# EasyEDA schematic SCH_GP40_keyboard.json
TITLE: GALAKSIJA Cherry MX Keyboard; REV: 1.0; Date: 2024-01-01; Sheet: 1/1; Drawn By: mikica; Company: Umuntu ngumuntu ngabuntu
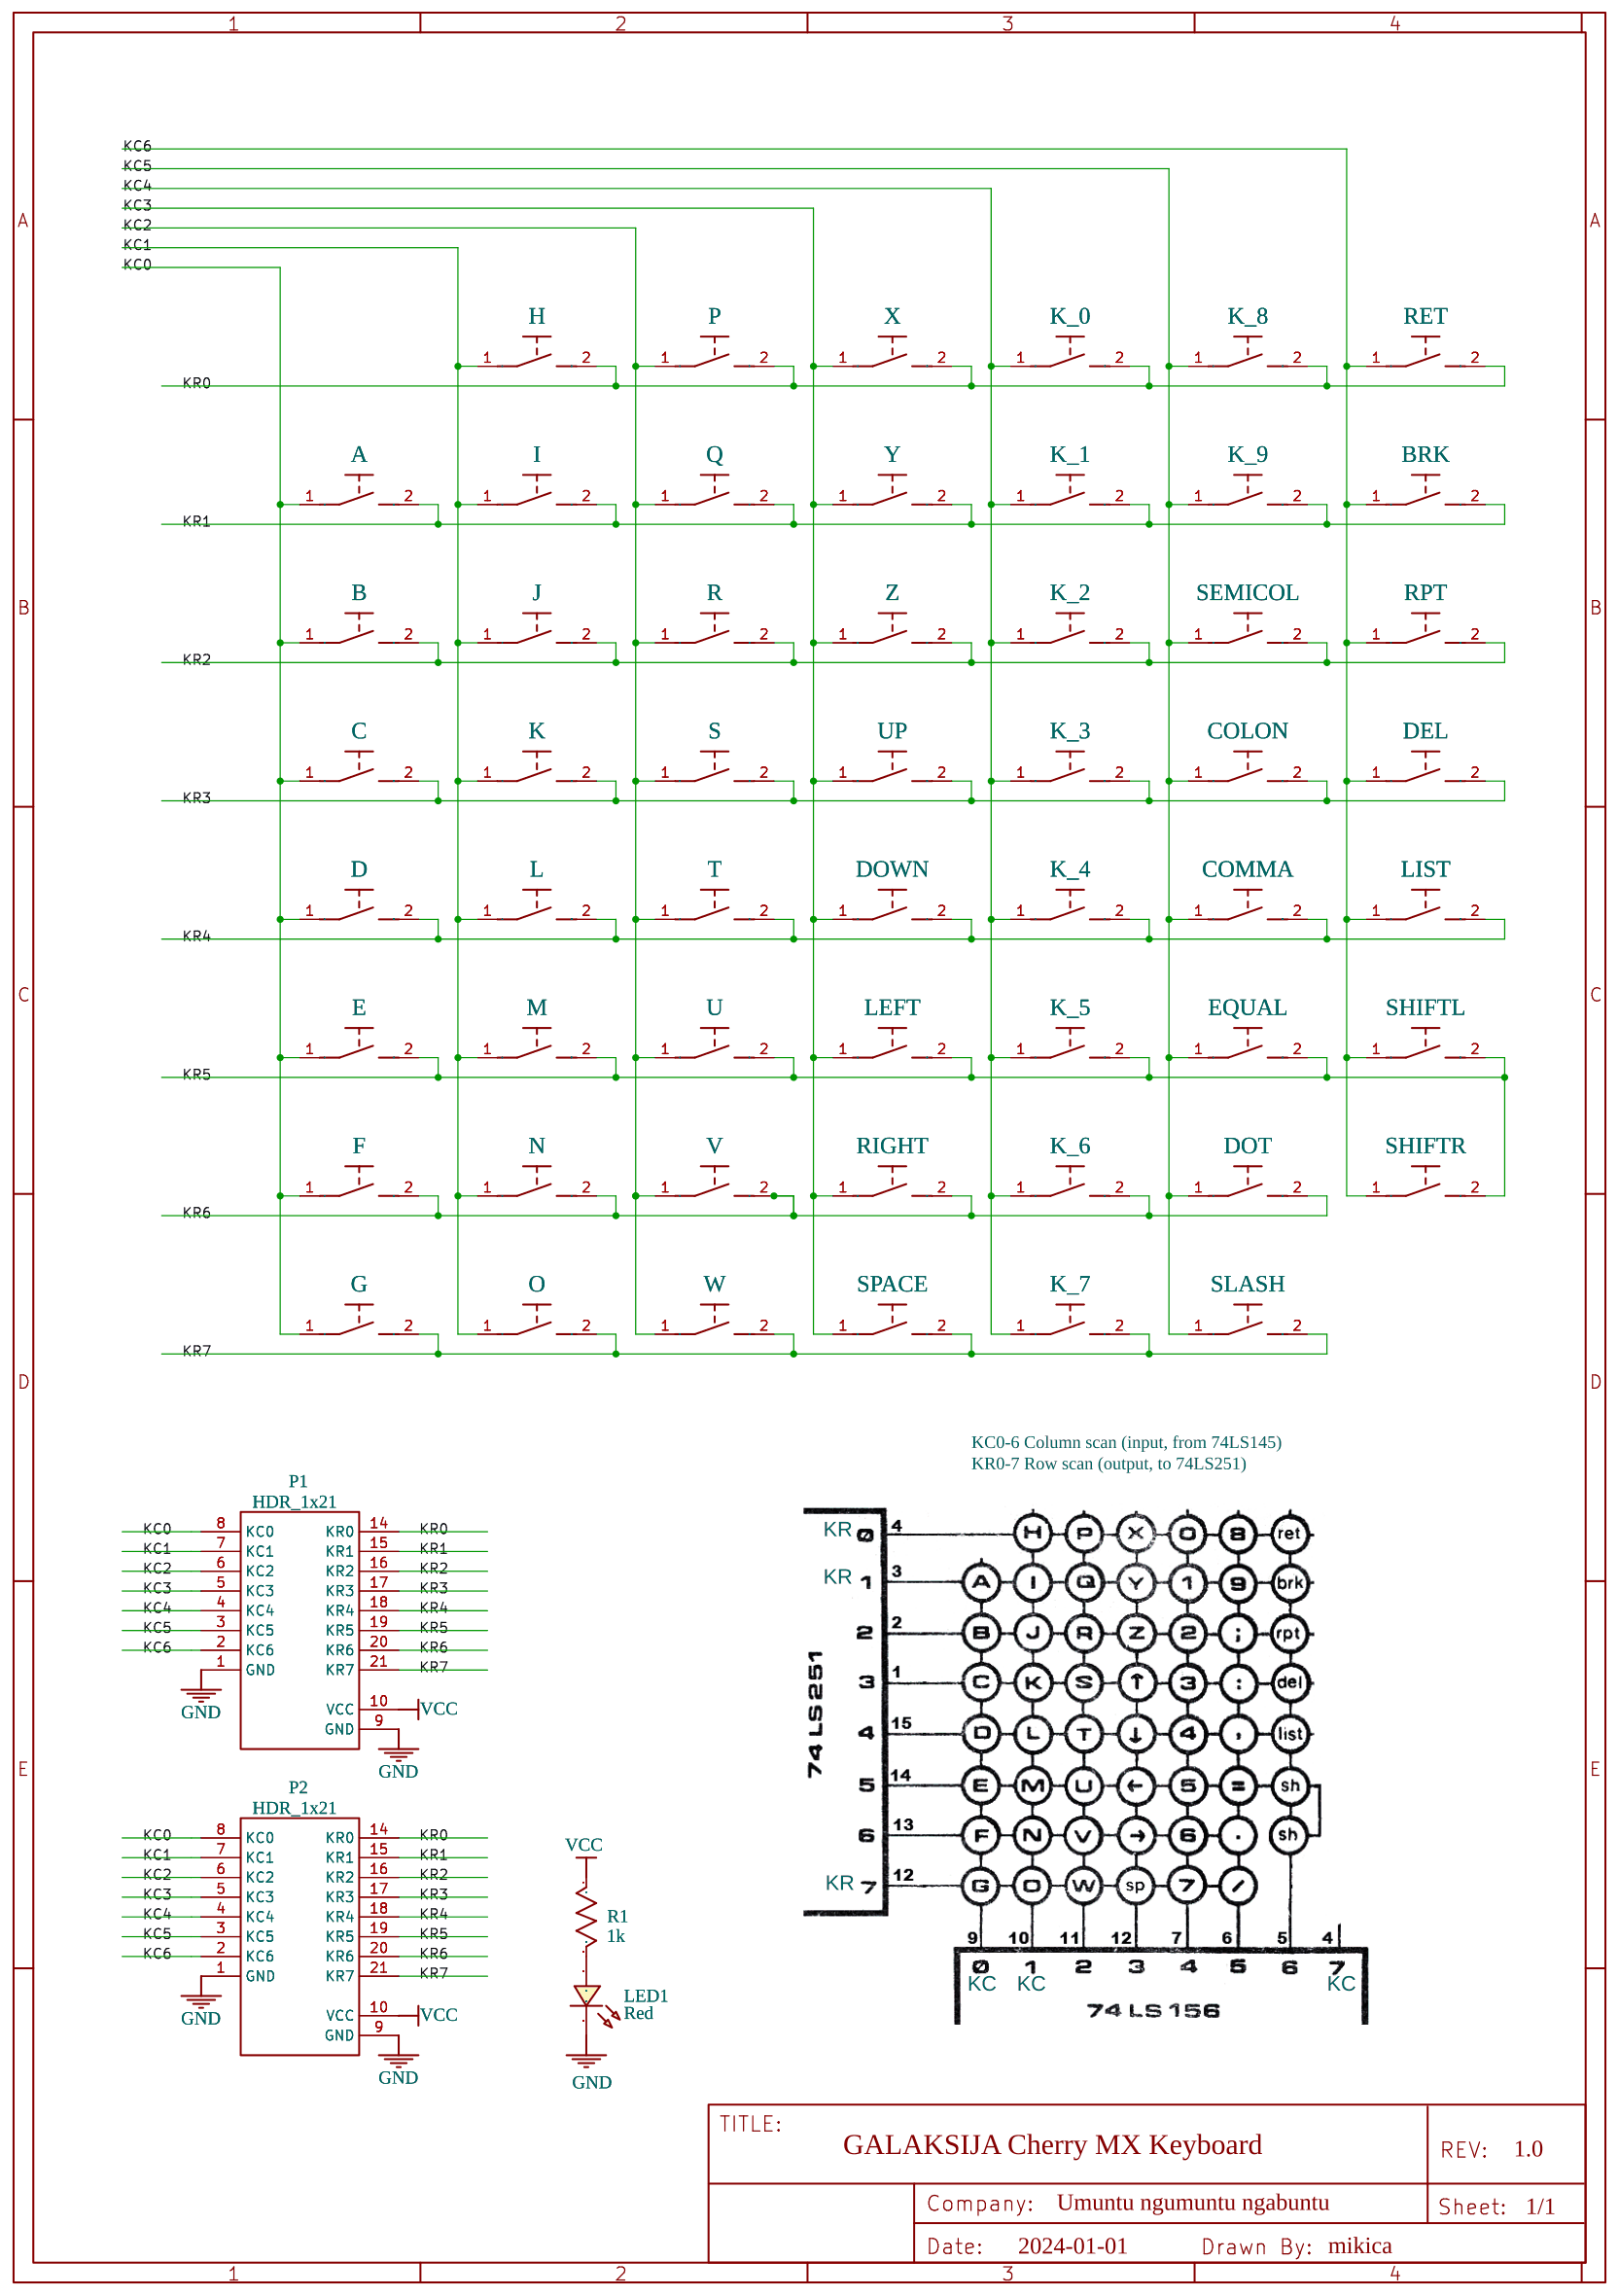
[diagram p0: schematic sheet]

## Parts
A  CPG151101S21  [KEY-TH_CPG1511F01S0X_MK]
B  CPG151101S21  [KEY-TH_CPG1511F01S0X_MK]
BRK  CPG151101S21  [KEY-TH_CPG1511F01S0X_MK]
C  CPG151101S21  [KEY-TH_CPG1511F01S0X_MK]
COLON  CPG151101S21  [KEY-TH_CPG1511F01S0X_MK]
COMMA  CPG151101S21  [KEY-TH_CPG1511F01S0X_MK]
D  CPG151101S21  [KEY-TH_CPG1511F01S0X_MK]
DEL  CPG151101S21  [KEY-TH_CPG1511F01S0X_MK]
DOT  CPG151101S21  [KEY-TH_CPG1511F01S0X_MK]
DOWN  CPG151101S21  [KEY-TH_CPG1511F01S0X_MK]
E  CPG151101S21  [KEY-TH_CPG1511F01S0X_MK]
EQUAL  CPG151101S21  [KEY-TH_CPG1511F01S0X_MK]
F  CPG151101S21  [KEY-TH_CPG1511F01S0X_MK]
G  CPG151101S21  [KEY-TH_CPG1511F01S0X_MK]
H  CPG151101S21  [KEY-TH_CPG1511F01S0X_MK]
I  CPG151101S21  [KEY-TH_CPG1511F01S0X_MK]
J  CPG151101S21  [KEY-TH_CPG1511F01S0X_MK]
K  CPG151101S21  [KEY-TH_CPG1511F01S0X_MK]
K_0  CPG151101S21  [KEY-TH_CPG1511F01S0X_MK]
K_1  CPG151101S21  [KEY-TH_CPG1511F01S0X_MK]
K_2  CPG151101S21  [KEY-TH_CPG1511F01S0X_MK]
K_3  CPG151101S21  [KEY-TH_CPG1511F01S0X_MK]
K_4  CPG151101S21  [KEY-TH_CPG1511F01S0X_MK]
K_5  CPG151101S21  [KEY-TH_CPG1511F01S0X_MK]
K_6  CPG151101S21  [KEY-TH_CPG1511F01S0X_MK]
K_7  CPG151101S21  [KEY-TH_CPG1511F01S0X_MK]
K_8  CPG151101S21  [KEY-TH_CPG1511F01S0X_MK]
K_9  CPG151101S21  [KEY-TH_CPG1511F01S0X_MK]
L  CPG151101S21  [KEY-TH_CPG1511F01S0X_MK]
LED1  Red  [LED-TH_BD3.0_RED]
LEFT  CPG151101S21  [KEY-TH_CPG1511F01S0X_MK]
LIST  CPG151101S21  [KEY-TH_CPG1511F01S0X_MK]
M  CPG151101S21  [KEY-TH_CPG1511F01S0X_MK]
N  CPG151101S21  [KEY-TH_CPG1511F01S0X_MK]
O  CPG151101S21  [KEY-TH_CPG1511F01S0X_MK]
P  CPG151101S21  [KEY-TH_CPG1511F01S0X_MK]
P1  HDR_1x21  [GP40_KBD]
P2  HDR_1x21  [GP40_KBD]
Q  CPG151101S21  [KEY-TH_CPG1511F01S0X_MK]
R  CPG151101S21  [KEY-TH_CPG1511F01S0X_MK]
R1  1k  [R0805_MK]
RET  CPG151101S21  [KEY-TH_CPG1511F01S0X_MK]
RIGHT  CPG151101S21  [KEY-TH_CPG1511F01S0X_MK]
RPT  CPG151101S21  [KEY-TH_CPG1511F01S0X_MK]
S  CPG151101S21  [KEY-TH_CPG1511F01S0X_MK]
SEMICOL  CPG151101S21  [KEY-TH_CPG1511F01S0X_MK]
SHIFTL  CPG151101S21  [KEY-TH_CPG1511F01S0X_MK]
SHIFTR  CPG151101S21  [KEY-TH_CPG1511F01S0X_MK]
SLASH  CPG151101S21  [KEY-TH_CPG1511F01S0X_MK]
SPACE  CPG151101S21  [KEY-TH_CPG1511F01S0X_MK]
T  CPG151101S21  [KEY-TH_CPG1511F01S0X_MK]
U  CPG151101S21  [KEY-TH_CPG1511F01S0X_MK]
UP  CPG151101S21  [KEY-TH_CPG1511F01S0X_MK]
V  CPG151101S21  [KEY-TH_CPG1511F01S0X_MK]
W  CPG151101S21  [KEY-TH_CPG1511F01S0X_MK]
X  CPG151101S21  [KEY-TH_CPG1511F01S0X_MK]
Y  CPG151101S21  [KEY-TH_CPG1511F01S0X_MK]
Z  CPG151101S21  [KEY-TH_CPG1511F01S0X_MK]

## Library data of the parts
A B BRK C COLON COMMA D DEL DOT DOWN E EQUAL F G H I J K K_0-K_9 L LEFT LIST M N O P Q R RET RIGHT RPT S SEMICOL SHIFTL SHIFTR SLASH SPACE T U UP V W X Y Z = CPG151101S21: Contributor: LCSC; Supplier: LCSC; Supplier Part: C404351; Manufacturer: Kailh(凯华); JLCPCB Part Class: Extended Part
LED1 = LED-TH-3mm_R: Manufacturer: EVERLIGHT(台湾亿光); Manufacturer Part: 204-10SDRD/S530-A3-L; Supplier Part: C84774; Supplier: LCSC; Contributor: LCEDA_Lib
P1 P2 = GP40_KBD: Contributor: mikica
R1 = R_0805_US: Contributor: LCEDA_Lib

## Nets
GND: LED1.2 P1.1(GND) P1.9(GND) P2.1(GND) P2.9(GND)
VCC: P1.10(VCC) P2.10(VCC) R1.1
KC0: A.1 B.1 C.1 D.1 E.1 F.1 G.1 P1.8(KC0) P2.8(KC0)
KC1: H.1 I.1 J.1 K.1 L.1 M.1 N.1 O.1 P1.7(KC1) P2.7(KC1)
KC2: P.1 P1.6(KC2) P2.6(KC2) Q.1 R.1 S.1 T.1 U.1 V.1 W.1
KC3: DOWN.1 LEFT.1 P1.5(KC3) P2.5(KC3) RIGHT.1 SPACE.1 UP.1 X.1 Y.1 Z.1
KC4: K_0.1 K_1.1 K_2.1 K_3.1 K_4.1 K_5.1 K_6.1 K_7.1 P1.4(KC4) P2.4(KC4)
KC5: COLON.1 COMMA.1 DOT.1 EQUAL.1 K_8.1 K_9.1 P1.3(KC5) P2.3(KC5) SEMICOL.1 SLASH.1
KC6: BRK.1 DEL.1 LIST.1 P1.2(KC6) P2.2(KC6) RET.1 RPT.1 SHIFTL.1 SHIFTR.1
KR0: H.2 K_0.2 K_8.2 P.2 P1.14(KR0) P2.14(KR0) RET.2 X.2
KR1: A.2 BRK.2 I.2 K_1.2 K_9.2 P1.15(KR1) P2.15(KR1) Q.2 Y.2
KR2: B.2 J.2 K_2.2 P1.16(KR2) P2.16(KR2) R.2 RPT.2 SEMICOL.2 Z.2
KR3: C.2 COLON.2 DEL.2 K.2 K_3.2 P1.17(KR3) P2.17(KR3) S.2 UP.2
KR4: COMMA.2 D.2 DOWN.2 K_4.2 L.2 LIST.2 P1.18(KR4) P2.18(KR4) T.2
KR5: E.2 EQUAL.2 K_5.2 LEFT.2 M.2 P1.19(KR5) P2.19(KR5) SHIFTL.2 SHIFTR.2 U.2
KR6: DOT.2 F.2 K_6.2 N.2 P1.20(KR6) P2.20(KR6) RIGHT.2 V.2
KR7: G.2 K_7.2 O.2 P1.21(KR7) P2.21(KR7) SLASH.2 SPACE.2 W.2
Net-(LED1-1): LED1.1 R1.2

## Notes on the sheet
- KC0-6 Column scan (input, from 74LS145)
  KR0-7 Row scan (output, to 74LS251)
- KR
- KR
- KR
- KC
- KC
- KC
